# Altium schematic sheet CM5_GPIO.SchDoc
size 297 x 209 mm
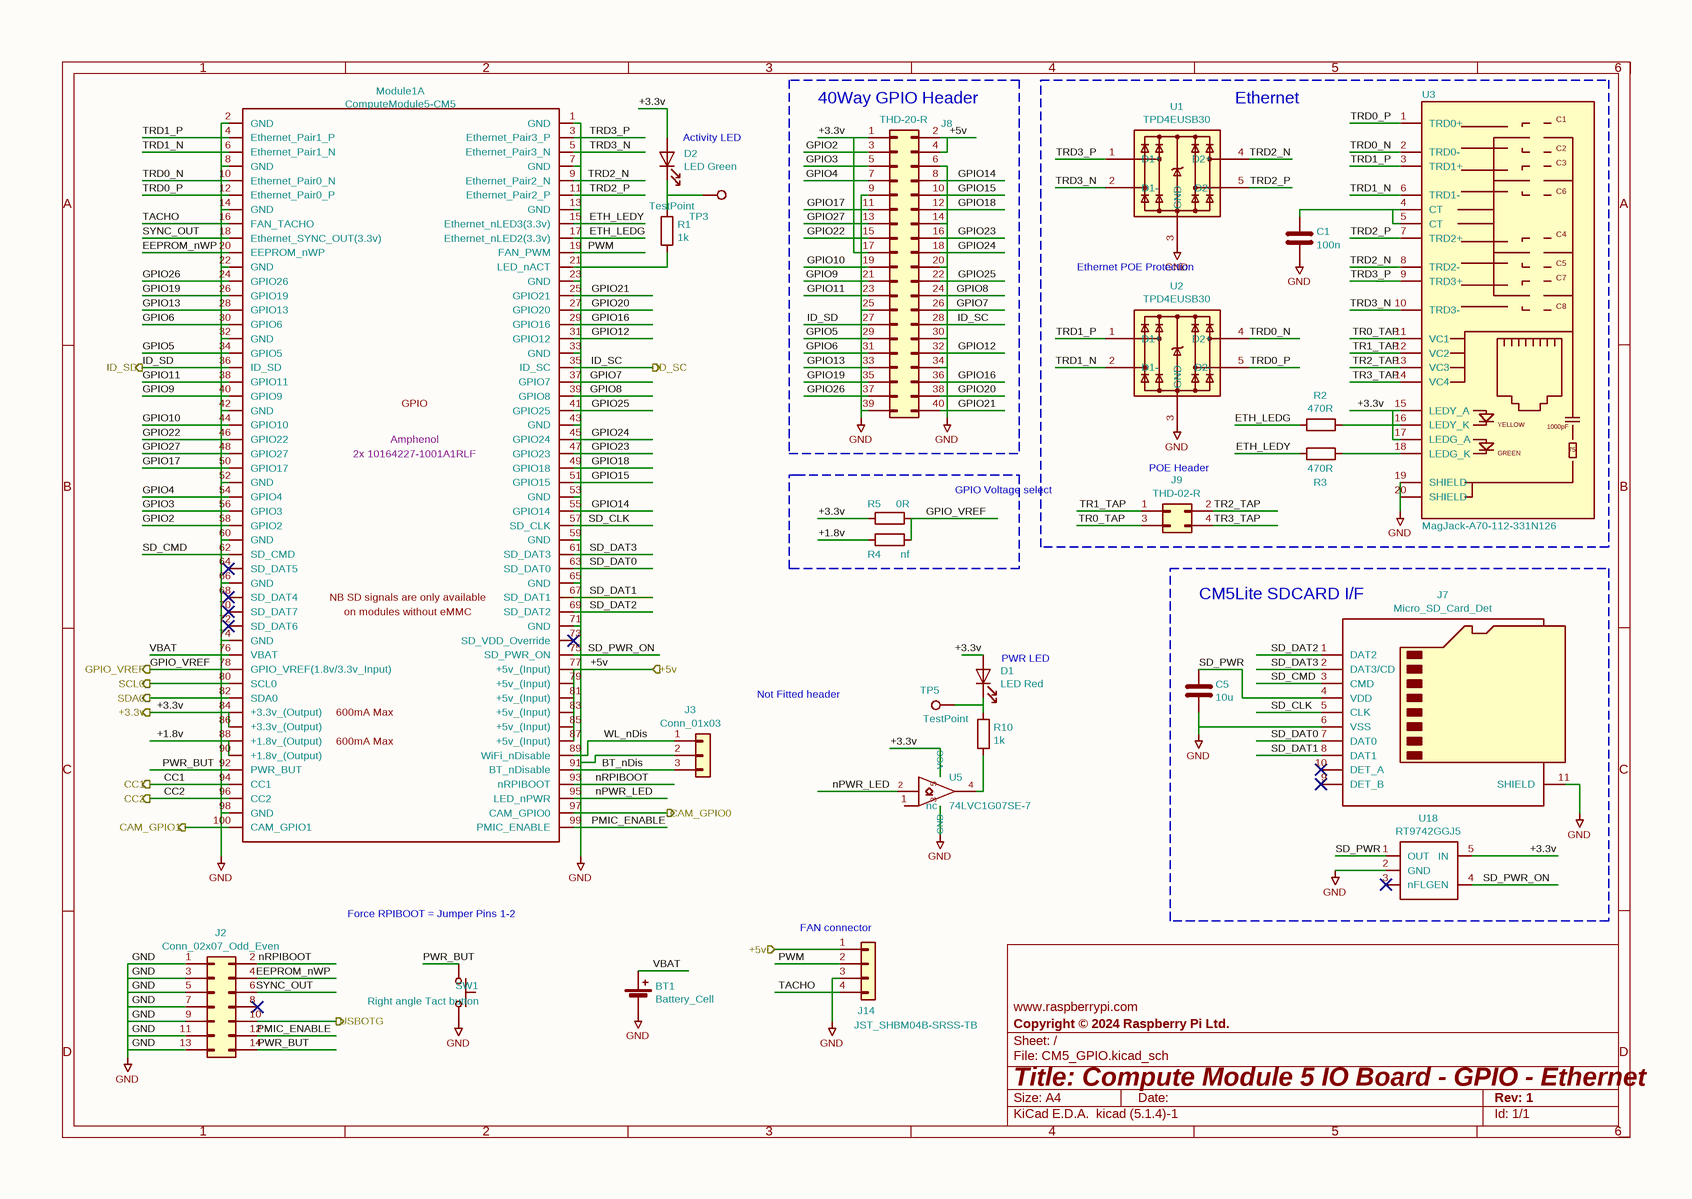
[diagram p0: CM5_GPIO.SchDoc]

## Parts
BT1  Battery_Cell  [BatteryHolder_Keystone_3034_1x20mm]
C1  100n  [C_0402_1005Metric]
C5  10u  [C_0805_2012Metric]
D1  LED Red  [LED_0603_1608Metric]
D2  LED Green  [LED_0603_1608Metric]
J2  Conn_02x07_Odd_Even  [PinHeader_2x07_P2.54mm_Vertical]
J3  Conn_01x03  [PinHeader_1x03_P2.54mm_Vertical]
J7  Micro_SD_Card_Det  [SDCARD_MOLEX_503398-1892]
J8  THD-20-R  [PinHeader_2x20_P2.54mm_Vertical]
J9  THD-02-R  [PinHeader_2x02_P2.54mm_Vertical]
J14  JST_SHBM04B-SRSS-TB  [JST_SH_BM04B-SRSS-TB_1x04-1MP_P1.00mm_Vertical]
Module1  Field4: Amphenol  Field5: 2x 10164227-1001A1RLF  [Raspberry-Pi-5-Compute-Module]  (hidden comment: ComputeModule5-CM5)  (part A of 2)
R1  1k  [R_0402_1005Metric]
R2  470R  [R_0402_1005Metric]
R3  470R  [R_0402_1005Metric]
R4  nf  [R_0805_2012Metric_Pad1.20x1.40mm_HandSolder]
R5  0R  [R_0805_2012Metric_Pad1.20x1.40mm_HandSolder]
R10  1k  [R_0402_1005Metric]
SW1  Right angle Tact button  [SW_Tactile_SPST_Angled_PTS645Vx58-2LFS]
TP3  TestPoint  [TestPoint_Pad_2.0x2.0mm]
TP5  TestPoint  [TestPoint_Pad_2.0x2.0mm]
U1  TPD4EUSB30  [USON-10_2.5x1.0mm_P0.5mm]
U2  TPD4EUSB30  [USON-10_2.5x1.0mm_P0.5mm]
U3  MagJack-A70-112-331N126  [TRJG0926HENL]
U5  74LVC1G07SE-7  [SOT-353_SC-70-5]
U18  RT9742GGJ5  [SOT-23-5]

## Blocks framed on the sheet
40Way GPIO Header: J8
Ethernet: C1 J9 R2 R3 U1-U3
GPIO Voltage select /: R4 R5
CM5Lite SDCARD I/F: C5 J7 U18

## Ports
+3.3v (out), +5v (in), CAM_GPIO0 (out), CAM_GPIO1 (out), CC1 (out), CC2 (out), GPIO_VREF (out), ID_SC (out), ID_SD (out), SCL0 (out), SDA0 (out), USBOTG (out)

## Nets
GND: BT1.2(-) C1.2 C5.2 J2.1(Pin_1) J2.3(Pin_3) J2.5(Pin_5) J2.7(Pin_7) J2.9(Pin_9) J2.11(Pin_11) J2.13(Pin_13) J3.2(Pin_2) J7.6(VSS) J7.11(SHIELD) J8.6(Pin_6) J8.9(Pin_9) J8.14(Pin_14) J8.20(Pin_20) J8.25(Pin_25) J8.30(Pin_30) J8.34(Pin_34) J8.39(Pin_39) J14.3(Pin_3) Module1.1(GND) Module1.2(GND) Module1.7(GND) Module1.8(GND) Module1.13(GND) Module1.14(GND) Module1.22(GND) Module1.23(GND) Module1.32(GND) Module1.33(GND) Module1.42(GND) Module1.43(GND) Module1.52(GND) Module1.53(GND) Module1.59(GND) Module1.60(GND) Module1.65(GND) Module1.66(GND) Module1.71(GND) Module1.74(GND) Module1.98(GND) SW1.2 U1.3(GND) U2.3(GND) U3.19(SHIELD) U3.20(SHIELD) U5.3(GND) U18.2(GND)
+1.8v: Module1.88(+1.8v_(Output)) Module1.90(+1.8v_(Output)) R4.1
+3.3v: D1.2(A) D2.2(A) J8.1(Pin_1) J8.17(Pin_17) Module1.84(+3.3v_(Output)) Module1.86(+3.3v_(Output)) R5.1 U3.15(LEDY_A) U3.17(LEDG_A) U5.5(VCC) U18.5(IN) ; port +3.3v
+5v: J8.2(Pin_2) J8.4(Pin_4) J14.1(Pin_1) Module1.77(+5v_(Input)) Module1.79(+5v_(Input)) Module1.81(+5v_(Input)) Module1.83(+5v_(Input)) Module1.85(+5v_(Input)) Module1.87(+5v_(Input)) ; port +5v
BT_nDis: J3.3(Pin_3) Module1.91(BT_nDisable)
CAM_GPIO0: Module1.97(CAM_GPIO0) ; port CAM_GPIO0
CAM_GPIO1: Module1.100(CAM_GPIO1) ; port CAM_GPIO1
CC1: Module1.94(CC1) ; port CC1
CC2: Module1.96(CC2) ; port CC2
EEPROM_nWP: J2.4(Pin_4) Module1.20(EEPROM_nWP)
ETH_LEDG: Module1.17(Ethernet_nLED2(3.3v)) R2.2
ETH_LEDY: Module1.15(Ethernet_nLED3(3.3v)) R3.2
GPIO2: J8.3(Pin_3) Module1.58(GPIO2)
GPIO3: J8.5(Pin_5) Module1.56(GPIO3)
GPIO4: J8.7(Pin_7) Module1.54(GPIO4)
GPIO5: J8.29(Pin_29) Module1.34(GPIO5)
GPIO6: J8.31(Pin_31) Module1.30(GPIO6)
GPIO7: J8.26(Pin_26) Module1.37(GPIO7)
GPIO8: J8.24(Pin_24) Module1.39(GPIO8)
GPIO9: J8.21(Pin_21) Module1.40(GPIO9)
GPIO10: J8.19(Pin_19) Module1.44(GPIO10)
GPIO11: J8.23(Pin_23) Module1.38(GPIO11)
GPIO12: J8.32(Pin_32) Module1.31(GPIO12)
GPIO13: J8.33(Pin_33) Module1.28(GPIO13)
GPIO14: J8.8(Pin_8) Module1.55(GPIO14)
GPIO15: J8.10(Pin_10) Module1.51(GPIO15)
GPIO16: J8.36(Pin_36) Module1.29(GPIO16)
GPIO17: J8.11(Pin_11) Module1.50(GPIO17)
GPIO18: J8.12(Pin_12) Module1.49(GPIO18)
GPIO19: J8.35(Pin_35) Module1.26(GPIO19)
GPIO20: J8.38(Pin_38) Module1.27(GPIO20)
GPIO21: J8.40(Pin_40) Module1.25(GPIO21)
GPIO22: J8.15(Pin_15) Module1.46(GPIO22)
GPIO23: J8.16(Pin_16) Module1.47(GPIO23)
GPIO24: J8.18(Pin_18) Module1.45(GPIO24)
GPIO25: J8.22(Pin_22) Module1.41(GPIO25)
GPIO26: J8.37(Pin_37) Module1.24(GPIO26)
GPIO27: J8.13(Pin_13) Module1.48(GPIO27)
GPIO_VREF: Module1.78(GPIO_VREF(1.8v/3.3v_Input)) R4.2 R5.2 ; port GPIO_VREF
ID_SC: J8.28(Pin_28) Module1.35(ID_SC) ; port ID_SC
ID_SD: J8.27(Pin_27) Module1.36(ID_SD) ; port ID_SD
nPWR_LED: Module1.95(LED_nPWR) U5.2
nRPIBOOT: J2.2(Pin_2) Module1.93(nRPIBOOT)
PMIC_ENABLE: J2.12(Pin_12) Module1.99(PMIC_ENABLE)
PWM: J14.2(Pin_2) Module1.19(FAN_PWM)
PWR_BUT: J2.14(Pin_14) Module1.92(PWR_BUT) SW1.1
SCL0: Module1.80(SCL0) ; port SCL0
SD_CLK: J7.5(CLK) Module1.57(SD_CLK)
SD_CMD: J7.3(CMD) Module1.62(SD_CMD)
SD_DAT0: J7.7(DAT0) Module1.63(SD_DAT0)
SD_DAT1: J7.8(DAT1) Module1.67(SD_DAT1)
SD_DAT2: J7.1(DAT2) Module1.69(SD_DAT2)
SD_DAT3: J7.2(DAT3/CD) Module1.61(SD_DAT3)
SD_PWR: C5.1 J7.4(VDD) U18.1(OUT)
SD_PWR_ON: Module1.75(SD_PWR_ON) U18.4(EN)
SDA0: Module1.82(SDA0) ; port SDA0
SYNC_OUT: J2.6(Pin_6) Module1.18(Ethernet_SYNC_OUT(3.3v))
TACHO: J14.4(Pin_4) Module1.16(FAN_TACHO)
TR0_TAP: J9.3(Pin_3) U3.11(VC1)
TR1_TAP: J9.1(Pin_1) U3.12(VC2)
TR2_TAP: J9.2(Pin_2) U3.13(VC3)
TR3_TAP: J9.4(Pin_4) U3.14(VC4)
TRD0_N: Module1.10(Ethernet_Pair0_N) U2.4(D2+) U3.2(TRD0-)
TRD0_P: Module1.12(Ethernet_Pair0_P) U2.5(D2-) U3.1(TRD0+)
TRD1_N: Module1.6(Ethernet_Pair1_N) U2.2(D1-) U3.6(TRD1-)
TRD1_P: Module1.4(Ethernet_Pair1_P) U2.1(D1+) U3.3(TRD1+)
TRD2_N: Module1.9(Ethernet_Pair2_N) U1.4(D2+) U3.8(TRD2-)
TRD2_P: Module1.11(Ethernet_Pair2_P) U1.5(D2-) U3.7(TRD2+)
TRD3_N: Module1.5(Ethernet_Pair3_N) U1.2(D1-) U3.10(TRD3-)
TRD3_P: Module1.3(Ethernet_Pair3_P) U1.1(D1+) U3.9(TRD3+)
USBOTG: J2.10(Pin_10) ; port USBOTG
VBAT: BT1.1(+) Module1.76(VBAT)
WL_nDis: J3.1(Pin_1) Module1.89(WiFi_nDisable)
NetC1_1: C1.1 U3.4(CT) U3.5(CT)
NetD1_1: D1.1(K) R10.1 TP5.1
NetD2_1: D2.1(K) R1.1 TP3.1
NetModule1_21: Module1.21(LED_nACT) R1.2
NetR2_1: R2.1 U3.16(LEDY_K)
NetR3_1: R3.1 U3.18(LEDG_K)
NetR10_2: R10.2 U5.4

Not connected (* = marked no-connect by the designer): J2 8(Pin_8)*; J7 9(DET_B)* 10(DET_A)*; Module1 64(SD_DAT5)* 68(SD_DAT4)* 70(SD_DAT7)* 72(SD_DAT6)* 73(SD_VDD_Override)*; U1 6 7 8(GND) 9 10; U2 6 7 8(GND) 9 10; U5 1(nc); U18 3(nFLG)*

## Notes on the sheet
- (near D2) Activity LED
- Ethernet POE
  Protection
- (near J9) POE Header
- Not Fitted header
- (near D1) PWR LED
- Force RPIBOOT = Jumper Pins 1-2
- (near J14) FAN connector
- 1
- 2
- 3
- 4
- 5
- 6
- A
- B
- C
- www.raspberrypi.com <http://www.raspberrypi.com>
- D
- Title: Compute Module 5 IO Board - GPIO - Ethernet
- File: CM5_GPIO.kicad_sch
- Sheet: /
- Copyright © 2024 Raspberry Pi Ltd.
- KiCad E.D.A.  kicad (5.1.4)-1
- Size: A4
- Date:
- Rev: 1
- Id: 1/1
- (in symbol ComputeModule5-CM5, part A) GPIO; NB SD signals are only available; on modules without eMMC; 600mA Max
- (in symbol MagJack-A70-112-331N126) C1; C2; C3; C6; C4; C5; C7; C8; YELLOW; 1000pF; 75; GREEN

## Library data of the parts
BT1 = Battery_Cell: Part Description: Battery Retainer Coin, 20.0mm 1 Cell SMD (SMT) Tab; Field4: Digikey; Field5: 36-3034-ND; Field6: 3034; Field7: Keystone; Value: Battery_Cell; Footprint: CM5IO:BatteryHolder_Keystone_3034_1x20mm
C1 = C: Part Description: 0.1uF 10% 16V Ceramic Capacitor X7R 0402 (1005 Metric); Field4: Farnell; Field5: 2611911; Field6: RM EMK105 B7104KV-F; Field7: TAIYO YUDEN EUROPE GMBH; Field8: 110091611; Value: 100n; Footprint: Capacitor_SMD:C_0402_1005Metric
C5 = C: Part Description: 10uF 10% 10V Ceramic Capacitor X7R 0805 (2012 Metric); Field5: 490-14381-1-ND; Field4: Digikey; Field6: GRM21BR71A106KA73L; Field7: Murata; Field8: 111893011; Value: 10u; Footprint: Capacitor_SMD:C_0805_2012Metric
D1 = LED_1: Part Description: Red 620nm LED Indication - Discrete 2.2V 2-SMD, No Lead; Field4: Digikey; Field5: LTST-S270KRKT; Field6: SML-A12U8TT86Q; Field7: Rohm; Field8: 650295101; Value: LED Red; Footprint: LED_SMD:LED_0603_1608Metric
D2 = LED: Part Description: Green 572nm LED Indication - Discrete 2.2V 2-SMD, No Lead; Field4: Digikey; Field5: LTST-S270KGKT; Field6: SML-A12M8TT86N; Field7: Rohm; Field8: 650263301; Value: LED Green; Footprint: LED_SMD:LED_0603_1608Metric
J2 = Conn_02x07_Odd_Even: Field4: Toby; Field5: THD-07-R; Field6: THD-07-R; Field7: Toby; Part Description: PinHeader_2x07_P2.54mm_Vertical; Value: Conn_02x07_Odd_Even; Footprint: Connector_PinHeader_2.54mm:PinHeader_2x07_P2.54mm_Vertical
J3 = Conn_01x03: Part Description: 3pin 0.1" connector; Field4: nf; Field5: nf; Field6: nf; Field7: nf; Value: Conn_01x03; Footprint: Connector_PinHeader_2.54mm:PinHeader_1x03_P2.54mm_Vertical
J7 = Micro_SD_Card_Det2: Part Description: 9 (8 + 1) Position Card Connector microSD™ Surface Mount, Right Angle Gold; Field4: Farnell; Field5: 2358234; Field6: 503398-1892; Field7: Molex; Field8: UCON00512; Value: Micro_SD_Card_Det; Footprint: CM5IO:SDCARD_MOLEX_503398-1892
J8 = Conn_02x20_Odd_Even: Field4: Toby; Field8: UCON00511; Field5: THD-20-R; Field6: THD-20-R; Field7: Toby; Part Description: PinHeader_2x20_P2.54mm_Vertical; Value: THD-20-R; Footprint: Connector_PinHeader_2.54mm:PinHeader_2x20_P2.54mm_Vertical
J9 = Conn_02x02_Odd_Even: Field4: Toby; Field6: 151-604-425-761; Field7: EDAC; Field8: UCON00791; Field5: THD-02-R; Part Description: PinHeader_2x02_P2.54mm_Vertical; Value: THD-02-R; Footprint: Connector_PinHeader_2.54mm:PinHeader_2x02_P2.54mm_Vertical
J14 = Conn_01x04: Part Description: 4 pin vertical 1mm pitch connector; Field7: JST; Field5: SHBM04B-SRSS-TB; Field6: SHBM04B-SRSS-TB; Value: JST_SHBM04B-SRSS-TB; Footprint: Connector_JST:JST_SH_BM04B-SRSS-TB_1x04-1MP_P1.00mm_Vertical
Module1 = ComputeModule5-CM5: Part Description: 100 Position Connector Receptacle, Center Strip Contacts Surface Mount Gold; Description: RaspberryPi Compute module 5; Field7: Hirose; Field6: 2x 10164227-1001A1RLF; Value: ComputeModule5-CM5; Footprint: CM5IO:Raspberry-Pi-5-Compute-Module
R1 R10 = R: Part Description: Resistor 1K M1005 1% 63mW; Field4: Farnell; Field5: 9239235; Field7: KOA EUROPE GMBH; Field6: RK73H1ETTP1001F; Field8: 125049511; Value: 1k; Footprint: Resistor_SMD:R_0402_1005Metric
R2 R3 = R: Part Description: Resistor 470R M1005 1% 63mW; Field4: Farnell; Field5: 9239197; Field7: KOA EUROPE GMBH; Field6: RK73G1ETQTP4700D; Field8: 120887981; Value: 470R; Footprint: Resistor_SMD:R_0402_1005Metric
R4 = R: Field4: nf; Field5: nf; Field6: nf; Value: nf; Footprint: Resistor_SMD:R_0805_2012Metric_Pad1.20x1.40mm_HandSolder
R5 = R: Part Description: Resistor 0R M2012 5%; Field4: Farnell; Field5: 9233750; Field7: Rohm; Field6: MCR10EZPJ000; Field8: 121629591; Value: 0R; Footprint: Resistor_SMD:R_0805_2012Metric_Pad1.20x1.40mm_HandSolder
SW1 = SW_Push: Part Description: Right angle through hole Tact switch; Description: Push button switch, generic, two pins; Field5: PTS645VH58-2LFS; Field7: CK; Field6: PTS645VH58-2LFS; Value: Right angle Tact button; Footprint: Button_Switch_THT:SW_Tactile_SPST_Angled_PTS645Vx58-2LFS
TP3 TP5 = TestPoint: Field4: nf; Field5: nf; Field6: nf; Field7: nf; Part Description: Test point; Value: TestPoint; Footprint: TestPoint:TestPoint_Pad_2.0x2.0mm
U1 U2 = TPD4EUSB30: Part Description: Quad TVS diode for high speed signals (USB3, GigE etc.); Field4: Farnell; Field5: 2335455; Field6: CDDFN10-3324P-13; Field7: Bourns; Field8: UDIO00346; Value: TPD4EUSB30; Footprint: Package_SON:USON-10_2.5x1.0mm_P0.5mm
U3 = MagJack-A70-112-331N126: Part Description: Gigabit Ethernet Magjack; Field7: Trxcon; Field8: UCON00900; Field6: TRJG0926HENL; Field5: TRJG0926HENL; Value: MagJack-A70-112-331N126; Footprint: CM5IO:TRJG0926HENL
U5 = 74LVC1G07_copy: Part Description: Buffer, Non-Inverting 1 Element 1 Bit per Element Open Drain Output SOT-353; Field4: Farnell; Field5: 2425492; Field7: Diodes; Field6: 74LVC1G07SE-7; Value: 74LVC1G07SE-7; Footprint: Package_TO_SOT_SMD:SOT-353_SC-70-5
U18 = RT9742GGJ5: Part Description: Power Switch/Driver 1:1 N-Channel 1A TSOT-23-5; Field4: Farnell; Field5: 2545875; Field7: RichTek; Field8: USWI00166; Field6: RT9742GGJ5; Value: RT9742GGJ5; Footprint: Package_TO_SOT_SMD:SOT-23-5